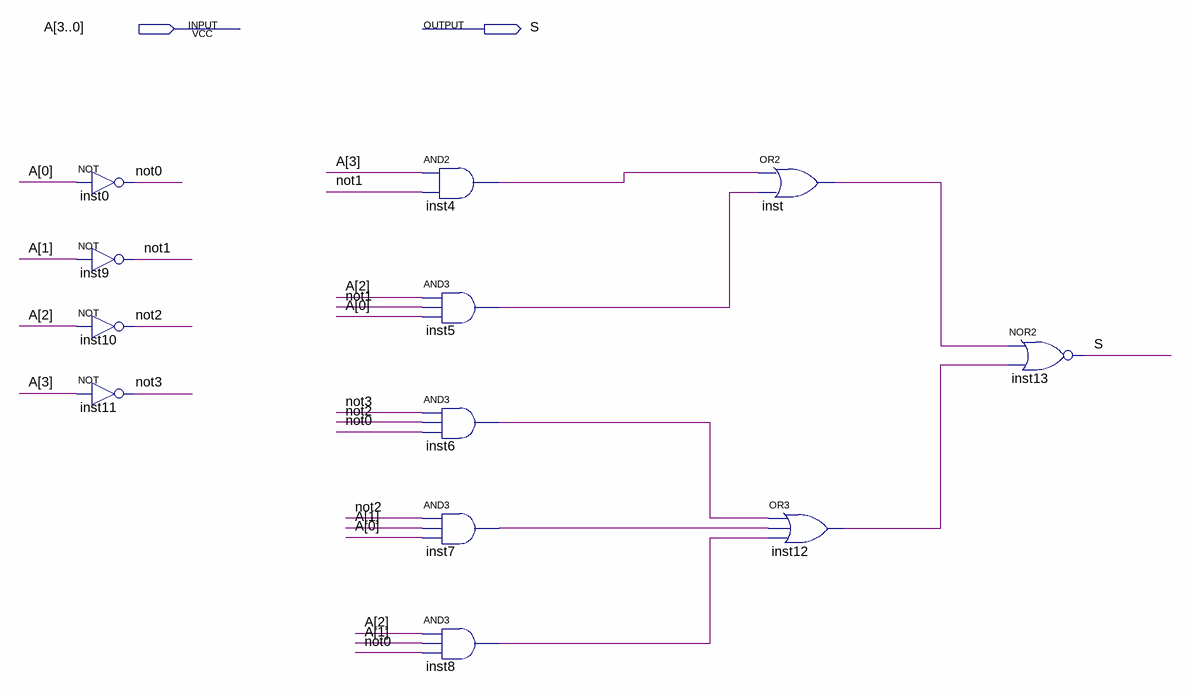
[diagram p0: schematic sheet]
// Quartus schematic segmentoD.bdf as structural Verilog: 12 symbols, 2 pins
module segmentoD (
  input  [3:0] A,
  output S
);

  wire inst4_out, inst5_out, inst6_out, inst7_out, inst8_out, inst12_out, inst_out, not0, not1, not2, not3;

  not inst0 (not0, A[0]);
  not inst9 (not1, A[1]);
  not inst10 (not2, A[2]);
  not inst11 (not3, A[3]);
  and inst4 (inst4_out, A[3], not1);
  and inst5 (inst5_out, A[2], not1, A[0]);
  and inst6 (inst6_out, not3, not2, not0);
  and inst7 (inst7_out, not2, A[1], A[0]);
  and inst8 (inst8_out, A[2], A[1], not0);
  or inst (inst_out, inst4_out, inst5_out);
  or inst12 (inst12_out, inst6_out, inst7_out, inst8_out);
  nor inst13 (S, inst_out, inst12_out);
endmodule
